# Altium schematic sheet Power Management.SchDoc
size A3; SheetNumber: 3; SheetTotal: 5
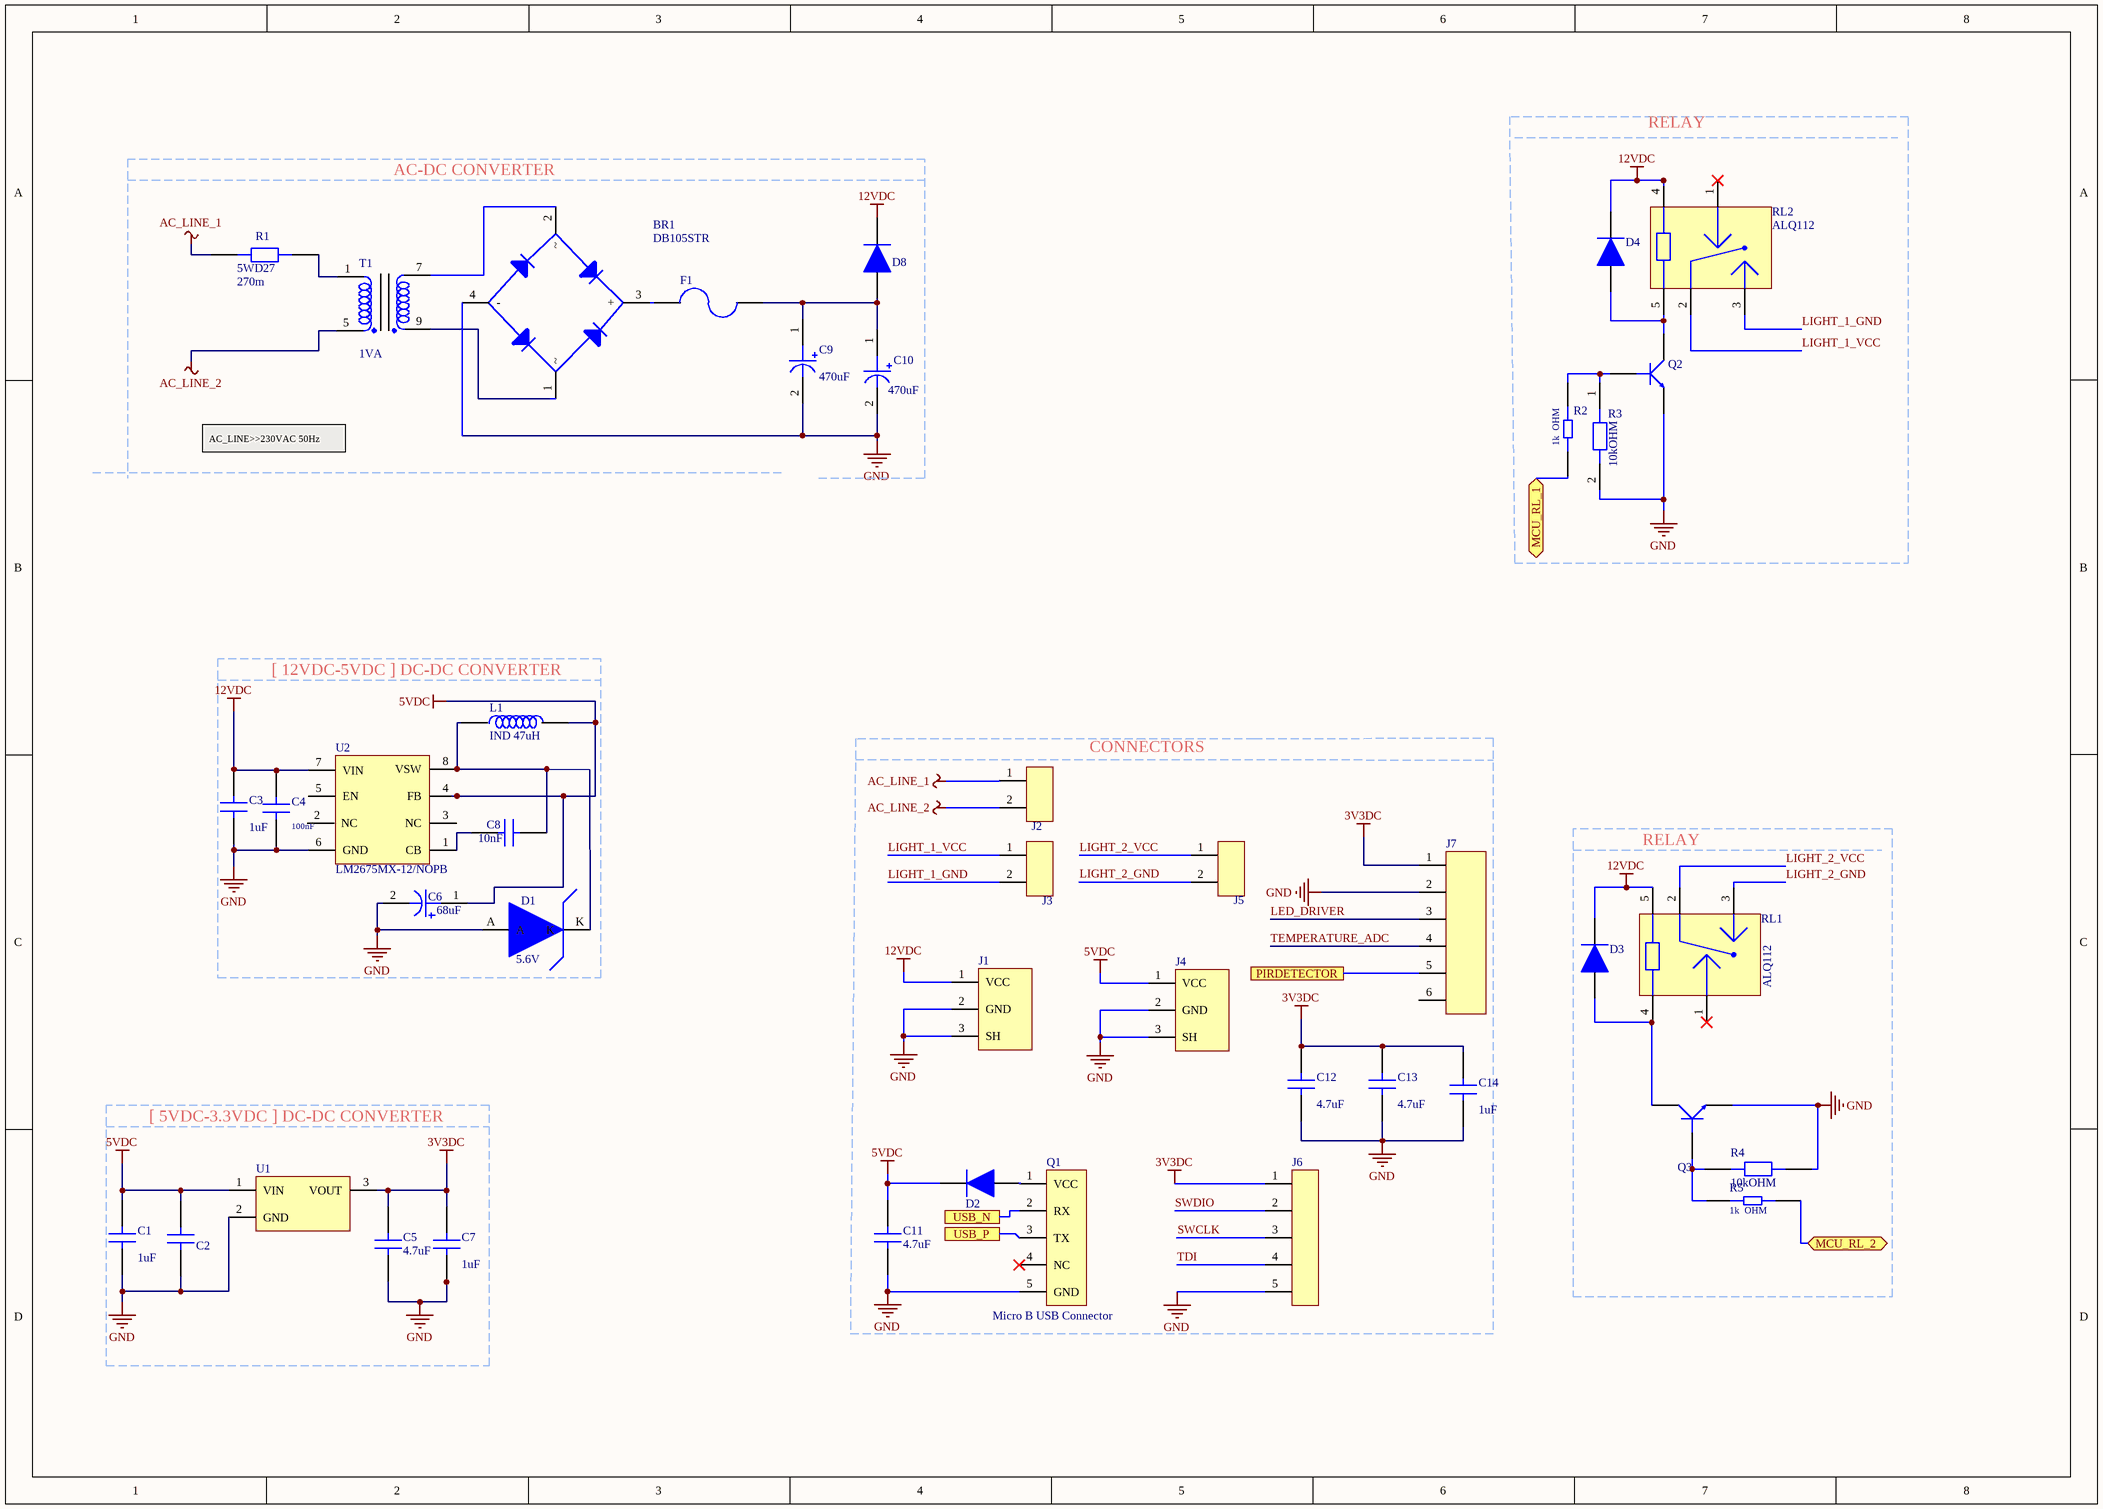
[diagram p0: Power Management.SchDoc]

## Parts
BR1  DB105STR  [DB1]
C1  Cap: 1uF  [CAP 0805]  (hidden comment: CAP CER 1uF)
C2  CAP CER 100nF 0603  [CAP_0603]  (value not drawn)
C3  Cap: 1uF  [CAP 0805]  (hidden comment: CAP CER 1uF)
C4  Capacitance: 100nF  [CAP 0805]  (hidden comment: CAP CER 100nF 0805)
C5  Cap: 4.7uF  [CAP 0805]  (hidden comment: CAP CER 4.7uF 0805)
C6  Capacitance: 68uF  [CAP EEVSERIES]  (hidden comment: CAP ALU 68uF)
C7  Cap: 1uF  [CAP 0805]  (hidden comment: CAP CER 1uF)
C8  Capacitance: 10nF  [CAP_0603]  (hidden comment: CAP CER 10nF 0603)
C9  Cap: 470uF  [CAP_RADIAL_D10_P5]  (hidden comment: ESH477M050AH4AA)
C10  Cap: 470uF  [CAP_RADIAL_D10_P5]  (hidden comment: ESH477M050AH4AA)
C11  Cap: 4.7uF  [CAP 0805]  (hidden comment: CAP CER 4.7uF 0805)
C12  Cap: 4.7uF  [CAP 0805]  (hidden comment: CAP CER 4.7uF 0805)
C13  Cap: 4.7uF  [CAP 0805]  (hidden comment: CAP CER 4.7uF 0805)
C14  Cap: 1uF  [CAP 0805]  (hidden comment: CAP CER 1uF)
D1  Zener Voltage: 5.6V  [SZM]  (hidden comment: SZMMSZ52)
D2  1N4148WS  [SOD323F]  (value not drawn)
D3  1N4148WS  [SOD323F]  (value not drawn)
D4  1N4148WS  [SOD323F]  (value not drawn)
D8  1N4148WS  [SOD323F]  (value not drawn)
F1  FUSE 3413.0216.22  [FUSE 3413.0216.22]  (value not drawn)
J1  PJ-037AH-SMT-TR  [JACk]  (value not drawn)
J2  TBP01R1-508-02BE  [TBP01R1-508]  (value not drawn)
J3  TBP01R1-508-02BE  [TBP01R1-508]  (value not drawn)
J4  PJ-037AH-SMT-TR  [JACk]  (value not drawn)
J5  TBP01R1-508-02BE  [TBP01R1-508]  (value not drawn)
J6  SMH-105-02-L-S  [PINHEADER1X5_RA]  (value not drawn)
J7  64800611622_conn_6pin  [64800611622]  (value not drawn)
L1  IND 47uH  [IND_1212]
Q1  Micro B USB Connector  [MICRO_B_USB]
Q2  MMBT3904-7-F  [SOT-23F]  (value not drawn)
Q3  MMBT3904-7-F  [SOT-23F]  (value not drawn)
R1  5WD27  Resistance: 270m  [RES_AXIAL_W]
R2  Reisitance: 1k  OHM  [RES_0603]  (hidden comment: RES 1K OHM 0603)
R3  Resistance: 10kOHM  [RES_0603]  (hidden comment: RES 10K OHM 0603)
R4  Resistance: 10kOHM  [RES_0603]  (hidden comment: RES 10K OHM 0603)
R5  Reisitance: 1k  OHM  [RES_0603]  (hidden comment: RES 1K OHM 0603)
RL1  ALQ112  [ALQ112]
RL2  ALQ112  [ALQ112]
T1  Rated Power: 1VA  [BV302S]  (hidden comment: BV302S12010-ZU)
U1  AP7361-33E-13  [SOT223]  (value not drawn)
U2  LM2675MX-12/NOPB  [SOIC8]

## Blocks framed on the sheet
RELAY: D4 Q2 R2 R3 RL2
[ 12VDC-5VDC ] DC-DC CONVERTER: C3 C4 C6 C8 D1 L1 U2
CONNECTORS: C11-C14 D2 J1-J7 Q1
RELAY: D3 Q3 R4 R5 RL1
[ 5VDC-3.3VDC ] DC-DC CONVERTER: C1 C2 C5 C7 U1

## Ports
MCU_RL_1 (bidir, see Microcontroller[6800,6750]), MCU_RL_2 (bidir, see Microcontroller[6809.449,6650]), PIRDETECTOR (see Microcontroller[6600,6350]), USB_N (see Microcontroller[7000,8850]), USB_P (see Microcontroller[6900,7750])

## Nets
3V3DC: C5.1 C7.2 C12.2 C13.2 C14.2 J6.1 J7.1 U1.3(VOUT)
5VDC: C1.2 C2.2 C6.1 C11.1 D2.1 J4.1(VCC) L1.2 U1.1(VIN) U2.4(FB)
12VDC: C3.1 C4.2 D3.1 D4.1 D8.1 J1.1(VCC) RL1.5 RL2.4 U2.7(VIN)
AC_LINE_1: J2.1 R1.1
AC_LINE_2: J2.2 T1.5
GND: BR1.4(-) C1.1 C2.1 C3.2 C4.1 C5.2 C6.2 C7.1 C9.2 C10.2 C11.2 C12.1 C13.1 C14.1 D1.A J1.2(GND) J1.3(SH) J4.2(GND) J4.3(SH) J6.5 J7.2 Q1.5(GND) Q2.2(E) Q3.2(E) R3.2 R4.1 U1.2(GND) U2.6(GND)
LED_DRIVER: J7.3
LIGHT_1_GND: J3.2 RL2.3
LIGHT_1_VCC: J3.1 RL2.2
LIGHT_2_GND: J5.2 RL1.3
LIGHT_2_VCC: J5.1 RL1.2
MCU_RL_1: R2.1 ; port MCU_RL_1
MCU_RL_2: R5.1 ; port MCU_RL_2
PIRDETECTOR: J7.5 ; port PIRDETECTOR
SWCLK: J6.3
SWDIO: J6.2
TDI: J6.4
TEMPERATURE_ADC: J7.4
USB_N: Q1.2(RX) ; port USB_N
USB_P: Q1.3(TX) ; port USB_P
NetBR1_1: BR1.1 T1.9
NetBR1_2: BR1.2 T1.7
NetBR1_3: BR1.3(+) F1.1
NetC8_1: C8.1 U2.1(CB)
NetC8_2: C8.2 D1.K L1.1 U2.8(VSW)
NetC9_1: C9.1 C10.1 D8.2 F1.2
NetD2_2: D2.2 Q1.1(VCC)
NetD3_2: D3.2 Q3.3(C) RL1.4
NetD4_2: D4.2 Q2.3(C) RL2.5
NetQ2_1: Q2.1(B) R2.2 R3.1
NetQ3_1: Q3.1(B) R4.2 R5.2
NetR1_2: R1.2 T1.1

Not connected (* = marked no-connect by the designer): J7 6; Q1 4(NC)*; RL1 1*; RL2 1*; U2 2(NC) 3(NC) 5(EN)

## Notes on the sheet
- (near BR1) AC-DC CONVERTER
- AC_LINE>>230VAC 50Hz
- Programing
  Connection

## Library data of the parts
BR1 = DB105STR: Bridge Rect 1PHASE 600V 1A Db-s; Manufacturer: SMC; Supplier 1: Future Electronics; Manufacturer Part Number: DB105STR; RoHS: No; Category: Industrial Control; Pricing 1: 1500=0.0744, 4500=0.0716, 15000=0.0686, 30000=0.067, 60000=0.064 (USD); Mount: Surface Mount; Case/Package: SMD/SMT; Min Operating Temperature: -55°C; Max Operating Temperature: 150°C; Packaging: Tape and Reel; Average Rectified Current: 1A; ComponentLink1URL: http://www.smc-diodes.com/propdf/DB101S%20THRU%20DB107S%20N1459%20REV.B.pdf?src-supplier=Digi-Key; ComponentLink1Description: http://www.smc-diodes.com/propdf/DB101S%20THRU%20DB107S%20N1459%20REV.B.pdf?src-supplier=Digi-Key; Supplier Part Number 1: 5119461; Case/Packag: *
C4 = CAP CER 100nF 0805: Multilayer Ceramic Capacitor, VJ Series, 0.1 - F, - 10%, X7R, 50 V, 0805 [2012 Metric]; Manufacturer: Vishay Vitramon; Manufacturer Part Number: VJ0805Y104KNAAT; Voltage Rating (DC): 50V; Supplier 1: Farnell; RoHS: Yes; Category: Ceramic Capacitors; Pricing 1: 5=0.523, 50=0.312, 250=0.297, 500=0.214, 1500=0.201, 3000=0.17, 15000=0.15, 30000=0.147 (EUR); Mount: Surface Mount; Case/Package: 0805; Case Code (Metric): 2012; Case Code (Imperial): 0805; Min Operating Temperature: -55°C; Max Operating Temperature: 125°C; Tolerance: 10%; Dielectric: X7R; Packaging: Tape and Reel; Termination: SMD/SMT; Series: VJ; Package Quantity: 1; Construction: Flat; Voltage Rating: 50V; Voltage: 50V; Length: 2mm; Width: 0.049inch; Height: 1.45mm; Depth: 1.25mm; Thickness: 0.057inch; Radiation Hardening: No; RoHS Compliant: Yes; Reach SVHC Compliant: Unknown; ComponentLink1URL: https://datasheet.ciiva.com/11785/0900766b8104796c-11785977.pdf?src-supplier=Rs; ComponentLink1Description: https://datasheet.ciiva.com/11785/0900766b8104796c-11785977.pdf?src-supplier=Rs; ComponentLink2URL: https://datasheet.ciiva.com/46417/1805046-46417861.pdf?src-supplier=Element14; ComponentLink2Description: https://datasheet.ciiva.com/46417/1805046-46417861.pdf?src-supplier=Element14; ComponentLink3URL: https://datasheet.ciiva.com/46417/1805046-46417862.pdf?src-supplier=Element14; ComponentLink3Description: https://datasheet.ciiva.com/46417/1805046-46417862.pdf?src-supplier=Element14; ComponentLink4URL: https://datasheet.ciiva.com/148/nonmagneticepoxybond-148471.pdf?src-supplier=Digi-Key; ComponentLink4Description: https://datasheet.ciiva.com/148/nonmagneticepoxybond-148471.pdf?src-supplier=Digi-Key; ComponentLink5URL: https://datasheet.ciiva.com/148/nonmagneticepoxybond-148472.pdf?src-supplier=Digi-Key; ComponentLink5Description: https://datasheet.ciiva.com/148/nonmagneticepoxybond-148472.pdf?src-supplier=Digi-Key; ComponentLink6URL: https://datasheet.ciiva.com/148/nonmagneticepoxybond-148473.pdf?src-supplier=Digi-Key; ComponentLink6Description: https://datasheet.ciiva.com/148/nonmagneticepoxybond-148473.pdf?src-supplier=Digi-Key; Supplier Part Number 1: 2407330
C5 C11-C13 = CAP CER 4.7uF 0805: CAP CER 4.7UF 25V X5R 0805; Manufacturer: Samsung; Manufacturer Part Number: CL21A475KAQNNNE; Supplier 1: Arrow Electronics; RoHS: Yes; Category: Ceramic Capacitors; Stock 1: 906000; Pricing 1: 2000=0.0173, 4000=0.0169, 10000=0.0146, 14000=0.0133, 50000=0.0114, 100000=0.0096, 200000=0.0089 (USD); ComponentLink1URL: https://datasheet.ciiva.com/25798/cl21a475kaqnnne-25798882.pdf?src-supplier=Digi-Key; ComponentLink1Description: https://datasheet.ciiva.com/25798/cl21a475kaqnnne-25798882.pdf?src-supplier=Digi-Key; Supplier Part Number 1: CL21A475KAQNNNE
C9 C10 = ESH477M050AH4AA: Cap, 470UF, 50V, Alu Elec, Radial; Manufacturer: KEMET; Supplier 1: Mouser; Manufacturer Part Number: ESH477M050AH4AA; RoHS: Yes; Stock 1: 3823; Pricing 1: 1=0.57, 10=0.4, 50=0.302, 100=0.263, 1000=0.263, 10000=0.263 (USD); ComponentLink1URL: https://api.kemet.com/component-edge/download/datasheet/ESH477M050AH4AA.pdf?src-supplier=Digi-Key; ComponentLink1Description: https://api.kemet.com/component-edge/download/datasheet/ESH477M050AH4AA.pdf?src-supplier=Digi-Key; ComponentLink2URL: https://datasheet.octopart.com/ESH477M050AH4AA-KEMET-datasheet-130075338.pdf?src-supplier=Newark; ComponentLink2Description: https://datasheet.octopart.com/ESH477M050AH4AA-KEMET-datasheet-130075338.pdf?src-supplier=Newark; Supplier Part Number 1: 80-ESH477M050AH4AA
D1 = SZMMSZ52: Diode Zener Single 16V 5% 500mW Automotive 2-Pin SOD-123 T/R; Manufacturer: ON Semiconductor; Manufacturer Part Number: SZMMSZ5246BT1G; Supplier 1: Arrow Electronics; RoHS: Yes; Category: Zener Diodes; Stock 1: 14410; Pricing 1: 1=0.3412, 10=0.2585, 25=0.2552, 100=0.1485, 250=0.1467, 500=0.0977, 1000=0.0743, 3000=0.0616, 6000=0.0574 (USD); ComponentLink1URL: https://datasheet.ciiva.com/10638/mmsz5221bt1-d-10638284.pdf?src-supplier=Avnet; ComponentLink1Description: https://datasheet.ciiva.com/10638/mmsz5221bt1-d-10638284.pdf?src-supplier=Avnet; ComponentLink2URL: https://datasheet.ciiva.com/900/mmsz5221bt1-d-900242.pdf?src-supplier=Digi-Key; ComponentLink2Description: https://datasheet.ciiva.com/900/mmsz5221bt1-d-900242.pdf?src-supplier=Digi-Key; Supplier Part Number 1: SZMMSZ5246BT1G
D2-D4 D8 = 1N4148WS: VR=75V IF=150mA Trr=4ns P=200mW; Manufacturer: ON Semiconductor / Fairchild; Supplier 1: Future Electronics; Manufacturer Part Number: 1N4148WS; RoHS: Yes; Category: Rectifier Diodes; Stock 1: 423000; Pricing 1: 3000=0.0191, 12000=0.0183, 45000=0.0175, 75000=0.0173, 150000=0.0164 (USD); ComponentLink1URL: https://datasheet.ciiva.com/30479/0900766b810e1cd3-30479206.pdf?src-supplier=Rs; ComponentLink1Description: https://datasheet.ciiva.com/30479/0900766b810e1cd3-30479206.pdf?src-supplier=Rs; ComponentLink2URL: https://datasheet.ciiva.com/8300/1n914bws-8300360.pdf?src-supplier=Avnet; ComponentLink2Description: https://datasheet.ciiva.com/8300/1n914bws-8300360.pdf?src-supplier=Avnet; ComponentLink3URL: https://datasheet.ciiva.com/15208/getdatasheetpartid-127819-15208358.pdf?src-supplier=Verical; ComponentLink3Description: https://datasheet.ciiva.com/15208/getdatasheetpartid-127819-15208358.pdf?src-supplier=Verical; ComponentLink4URL: https://datasheet.ciiva.com/910/1n4148ws-910380.pdf?src-supplier=Digi-Key; ComponentLink4Description: https://datasheet.ciiva.com/910/1n4148ws-910380.pdf?src-supplier=Digi-Key; ComponentLink5URL: https://datasheet.ciiva.com/910/1n4148ws-910381.pdf?src-supplier=Digi-Key; ComponentLink5Description: https://datasheet.ciiva.com/910/1n4148ws-910381.pdf?src-supplier=Digi-Key; ComponentLink6URL: https://datasheet.ciiva.com/910/1n4148ws-910382.pdf?src-supplier=Digi-Key; ComponentLink6Description: https://datasheet.ciiva.com/910/1n4148ws-910382.pdf?src-supplier=Digi-Key; Supplier Part Number 1: 8814485
F1 = FUSE 3413.0216.22: Fuse Chip Fast Acting 1A 32V SMD Solder Pad 1206 Glass T/R VDE/cULus; Manufacturer: Schurter; Supplier 1: Avnet; Manufacturer Part Number: 3413.0216.22; RoHS: Yes; Category: Fuses; Stock 1: 2000; Pricing 1: 1000=0.37339, 2000=0.3654, 4000=0.35496, 6000=0.34713, 8000=0.33408, 10000=0.32625, 100000=0.31842 (USD); ComponentLink1URL: https://datasheet.ciiva.com/301/typ-usi-1206-301440.pdf?src-supplier=Digi-Key; ComponentLink1Description: https://datasheet.ciiva.com/301/typ-usi-1206-301440.pdf?src-supplier=Digi-Key; ComponentLink2URL: https://datasheet.ciiva.com/14102/qousi1206-data-e-14102903.pdf?src-supplier=Distrelec; ComponentLink2Description: https://datasheet.ciiva.com/14102/qousi1206-data-e-14102903.pdf?src-supplier=Distrelec; ComponentLink3URL: https://datasheet.ciiva.com/16316/typ-usi-1206-16316588.pdf?src-supplier=Future+Electronics; ComponentLink3Description: https://datasheet.ciiva.com/16316/typ-usi-1206-16316588.pdf?src-supplier=Future+Electronics; ComponentLink4URL: https://datasheet.ciiva.com/301/typ-usi-1206-301439.pdf?src-supplier=Digi-Key; ComponentLink4Description: https://datasheet.ciiva.com/301/typ-usi-1206-301439.pdf?src-supplier=Digi-Key; ComponentLink5URL: https://datasheet.ciiva.com/301/typ-usi-1206-301441.pdf?src-supplier=Digi-Key; ComponentLink5Description: https://datasheet.ciiva.com/301/typ-usi-1206-301441.pdf?src-supplier=Digi-Key; ComponentLink6URL: https://datasheet.ciiva.com/8264/typ-usi-1206-8264583.pdf?src-supplier=Avnet; ComponentLink6Description: https://datasheet.ciiva.com/8264/typ-usi-1206-8264583.pdf?src-supplier=Avnet; ComponentLink7URL: https://datasheet.ciiva.com/14541/70160006-14541114.pdf?src-supplier=Allied+Electronics; ComponentLink7Description: https://datasheet.ciiva.com/14541/70160006-14541114.pdf?src-supplier=Allied+Electronics; Supplier Part Number 1: 3413.0216.22
J1 J4 = PJ-037AH-SMT-TR: 2.0 x 6.3 mm, 5.0 A, Horizontal, Surface Mount (SMT), Dc Power Jack Connector; Manufacturer: CUI; Number of Conductors: 2; Gender: Male; Shielding: Unshielded; Current Rating: 5A; Voltage Rating: 24V; Insulation Resistance: 100MR; Supplier 1: Mouser; Manufacturer Part Number: PJ-037AH-SMT-TR; RoHS: Yes; Category: Uncategorized; Mount: Surface Mount,Through Hole; Case/Package: SMD/SMT; Color: Black; Contact Material: Copper; Contact Plating: Nickel; Housing Color: Black; Housing Material: Thermoplastic; Min Operating Temperature: -25°C; Max Operating Temperature: 85°C; Orientation: Horizontal; Package Quantity: 200; Termination: Solder; Connector Type: Jack; Contact Gender: Male; Packaging: Tape and Reel; Flammability Rating: UL94 V-0; ComponentLink1URL: http://www.mouser.com/ds/2/670/pj-037ah-smt-516065.pdf?src-supplier=Mouser; ComponentLink1Description: http://www.mouser.com/ds/2/670/pj-037ah-smt-516065.pdf?src-supplier=Mouser; ComponentLink2URL: https://www.cui.com/product/resource/digikeypdf/pj-037ah-smt-tr.pdf?src-supplier=Digi-Key; ComponentLink2Description: https://www.cui.com/product/resource/digikeypdf/pj-037ah-smt-tr.pdf?src-supplier=Digi-Key; ComponentLink3URL: http://www.cui.com/product/resource/digikeypdf/pj-037ah-smt.pdf?src-supplier=Digi-Key; ComponentLink3Description: http://www.cui.com/product/resource/digikeypdf/pj-037ah-smt.pdf?src-supplier=Digi-Key; Supplier Part Number 1: 490-PJ-037AH-SMT-TR
L1 = IND 47uH: Power Inductor, Aec-Q200, 47Uh, 0.39A Rohs Compliant: Yes |Wurth Elektronik 78438335470; Manufacturer: Wurth Electronics; Core Material: Ferrite; Current Rating: 390mA; Saturation Current: 1.18A; Shielding: Shielded; DC Resistance (DCR): 2.3R; Self Resonant Frequency: 8MHz; Test Frequency: 100kHz; Tolerance: 30%; Supplier 1: Farnell; Manufacturer Part Number: 78438335470; RoHS: Yes; Category: Fixed Inductors; Stock 1: 1175; Pricing 1: 1=1.76, 50=1.67, 100=1.6, 250=1.52, 500=1.41, 1000=1.38, 5000=1.35, 10000=1.33 (EUR); Mount: Surface Mount; Case/Package: 1212; Case Code (Metric): 3030; Case Code (Imperial): 1212; Min Operating Temperature: -40°C; Max Operating Temperature: 125°C; Packaging: Cut Tape; Inductance: 47uH; Series: WE-MAIA; Length: 0.118inch; Width: 0.118inch; Height - Seated (Max): 0.059inch; Ratings: AEC-Q200; RoHS Compliant: Yes; ComponentLink1URL: https://media.digikey.com/pdf/Data%20Sheets/Wurth%20Electronics%20PDFs/Q+_Products_Flyer.pdf?src-supplier=Digi-Key; ComponentLink1Description: https://media.digikey.com/pdf/Data%20Sheets/Wurth%20Electronics%20PDFs/Q+_Products_Flyer.pdf?src-supplier=Digi-Key; Supplier Part Number 1: 3517060
T1 = BV302S12010-ZU: Primary Voltage: 230V; Secondary Voltage: 12V; Operating Frequency: 50-60 Hz
U1 = AP7361-33E-13: AP7361 Series 3.3 V 1 A Low SMT Dropout Fixed-Mode Regulator - SOT-223; Manufacturer: Diodes; Supplier 1: Future Electronics; Manufacturer Part Number: AP7361-33E-13; RoHS: Yes; Category: Voltage Regulators - Linear; Stock 1: 15000; Pricing 1: 2500=0.17, 7500=0.166, 12500=0.163, 50000=0.158, 75000=0.154 (USD); ComponentLink1URL: https://datasheet.ciiva.com/26926/getdatasheetpartid-670786-26926141.pdf?src-supplier=Verical; ComponentLink1Description: https://datasheet.ciiva.com/26926/getdatasheetpartid-670786-26926141.pdf?src-supplier=Verical; ComponentLink2URL: https://datasheet.ciiva.com/25651/ap7361-25651049.pdf?src-supplier=Digi-Key; ComponentLink2Description: https://datasheet.ciiva.com/25651/ap7361-25651049.pdf?src-supplier=Digi-Key; ComponentLink3URL: https://datasheet.ciiva.com/29568/ap7361-29568378.pdf?src-supplier=Digi-Key; ComponentLink3Description: https://datasheet.ciiva.com/29568/ap7361-29568378.pdf?src-supplier=Digi-Key; ComponentLink4URL: https://datasheet.ciiva.com/29568/ap7361-29568379.pdf?src-supplier=Digi-Key; ComponentLink4Description: https://datasheet.ciiva.com/29568/ap7361-29568379.pdf?src-supplier=Digi-Key; Supplier Part Number 1: 4058800; Case/Package: SOT223
U2 = LM2675MX-12/NOPB: SIMPLE SWITCHER® 6.5V to 40V, 1A Low Component Count Step-Down Regulator 8-SOIC -40 to 125; Manufacturer: TI National Semiconductor; Supplier 1: Digi-Key; Manufacturer Part Number: LM2675MX-12/NOPB; RoHS: Yes; Category: Voltage Regulators - Switching; Pricing 1: 1=4.85, 10=4.356, 25=4.1184, 100=3.5693, 250=3.38624, 500=3.03846, 1000=2.56256 (USD); ComponentLink1URL: https://datasheet.ciiva.com/41457/001013881-da-01-en-ic-reg-buck-lm2675mx-12-nopb-soic-8-tid-41457896.pdf?src-supplier=Conrad; ComponentLink1Description: https://datasheet.ciiva.com/41457/001013881-da-01-en-ic-reg-buck-lm2675mx-12-nopb-soic-8-tid-41457896.pdf?src-supplier=Conrad; ComponentLink2URL: https://datasheet.ciiva.com/3220/lm2675-3220840.pdf?src-supplier=Avnet; ComponentLink2Description: https://datasheet.ciiva.com/3220/lm2675-3220840.pdf?src-supplier=Avnet; Supplier Part Number 1: 296-35410-1-ND
C2 = CAP CER 100nF 0603: Case/Package: 0603; Parameter 1: *
RL1 RL2 = ALQ112: Case/Package: ALQ112